# Altium schematic sheet 1XGSH00.SchDoc
size A4
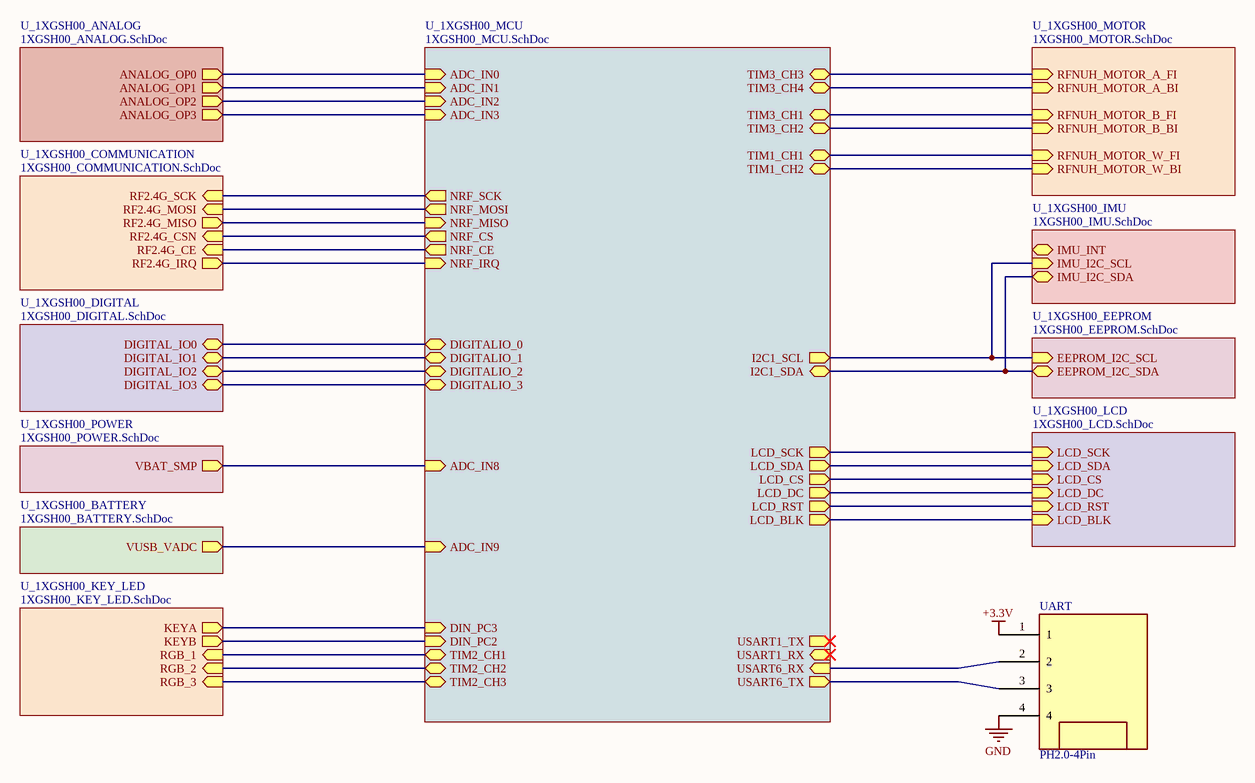
[diagram p0: 1XGSH00.SchDoc]

## Parts
UART  PH2.0-4Pin  [X1251WRS-04HF-LPSW]

## Sub-sheets
U_1XGSH00_ANALOG = 1XGSH00_ANALOG.SchDoc: ANALOG_OP0 (out), ANALOG_OP2 (out), ANALOG_OP3 (out), ANALOG_OP1 (out)
U_1XGSH00_BATTERY = 1XGSH00_BATTERY.SchDoc: VUSB_VADC (out)
U_1XGSH00_COMMUNICATION = 1XGSH00_COMMUNICATION.SchDoc: RF2.4G_SCK (in), RF2.4G_IRQ (out), RF2.4G_CE (in), RF2.4G_MISO (out), RF2.4G_MOSI (in), RF2.4G_CSN (in)
U_1XGSH00_DIGITAL = 1XGSH00_DIGITAL.SchDoc: DIGITAL_IO0 (bidir), DIGITAL_IO1 (bidir), DIGITAL_IO2 (bidir), DIGITAL_IO3 (bidir)
U_1XGSH00_EEPROM = 1XGSH00_EEPROM.SchDoc: EEPROM_I2C_SCL (in), EEPROM_I2C_SDA (bidir)
U_1XGSH00_IMU = 1XGSH00_IMU.SchDoc: IMU_I2C_SDA (bidir), IMU_I2C_SCL (in), IMU_INT (bidir)
U_1XGSH00_KEY_LED = 1XGSH00_KEY_LED.SchDoc: KEYA (out), KEYB (out), RGB_1 (in), RGB_2 (in), RGB_3 (in)
U_1XGSH00_LCD = 1XGSH00_LCD.SchDoc: LCD_SCK (in), LCD_SDA (in), LCD_DC (in), LCD_CS (in), LCD_RST (in), LCD_BLK (in)
U_1XGSH00_MCU = 1XGSH00_MCU.SchDoc: DIGITALIO_2 (bidir), DIGITALIO_3 (bidir), DIGITALIO_0 (bidir), DIGITALIO_1 (bidir), LCD_SCK (out), LCD_DC (out), LCD_BLK (out), LCD_SDA (out), LCD_CS (out), LCD_RST (out), TIM3_CH1 (bidir), ADC_IN8 (in), ADC_IN2 (in), NRF_CS (out), NRF_MISO (in), USART6_TX (out), TIM3_CH4 (bidir), USART1_RX (in), USART1_TX (out), TIM3_CH2 (bidir), TIM1_CH2 (bidir), TIM1_CH1 (bidir), I2C1_SCL (out), I2C1_SDA (bidir), ADC_IN3 (in), USART6_RX (in), TIM3_CH3 (bidir), TIM2_CH2 (bidir), NRF_CE (out), ADC_IN1 (in), NRF_IRQ (in), ADC_IN0 (in), NRF_SCK (out), NRF_MOSI (out), ADC_IN9 (in), TIM2_CH1 (bidir), TIM2_CH3 (bidir), DIN_PC2 (in), DIN_PC3 (in)
U_1XGSH00_MOTOR = 1XGSH00_MOTOR.SchDoc: RFNUH_MOTOR_W_BI (in), RFNUH_MOTOR_B_FI (in), RFNUH_MOTOR_A_FI (in), RFNUH_MOTOR_A_BI (in), RFNUH_MOTOR_W_FI (in), RFNUH_MOTOR_B_BI (in)
U_1XGSH00_POWER = 1XGSH00_POWER.SchDoc: VBAT_SMP (out)

## Nets
+3.3V: UART.1
GND: UART.4
NetUART_2: UART.2 ; sheet U_1XGSH00_MCU/USART6_RX
NetUART_3: UART.3 ; sheet U_1XGSH00_MCU/USART6_TX
(unnamed): sheet U_1XGSH00_ANALOG/ANALOG_OP0, sheet U_1XGSH00_MCU/ADC_IN0
(unnamed): sheet U_1XGSH00_ANALOG/ANALOG_OP2, sheet U_1XGSH00_MCU/ADC_IN2
(unnamed): sheet U_1XGSH00_ANALOG/ANALOG_OP3, sheet U_1XGSH00_MCU/ADC_IN3
(unnamed): sheet U_1XGSH00_ANALOG/ANALOG_OP1, sheet U_1XGSH00_MCU/ADC_IN1
(unnamed): sheet U_1XGSH00_BATTERY/VUSB_VADC, sheet U_1XGSH00_MCU/ADC_IN9
(unnamed): sheet U_1XGSH00_COMMUNICATION/RF2.4G_SCK, sheet U_1XGSH00_MCU/NRF_SCK
(unnamed): sheet U_1XGSH00_COMMUNICATION/RF2.4G_IRQ, sheet U_1XGSH00_MCU/NRF_IRQ
(unnamed): sheet U_1XGSH00_COMMUNICATION/RF2.4G_CE, sheet U_1XGSH00_MCU/NRF_CE
(unnamed): sheet U_1XGSH00_COMMUNICATION/RF2.4G_MISO, sheet U_1XGSH00_MCU/NRF_MISO
(unnamed): sheet U_1XGSH00_COMMUNICATION/RF2.4G_MOSI, sheet U_1XGSH00_MCU/NRF_MOSI
(unnamed): sheet U_1XGSH00_COMMUNICATION/RF2.4G_CSN, sheet U_1XGSH00_MCU/NRF_CS
(unnamed): sheet U_1XGSH00_DIGITAL/DIGITAL_IO0, sheet U_1XGSH00_MCU/DIGITALIO_0
(unnamed): sheet U_1XGSH00_DIGITAL/DIGITAL_IO1, sheet U_1XGSH00_MCU/DIGITALIO_1
(unnamed): sheet U_1XGSH00_DIGITAL/DIGITAL_IO2, sheet U_1XGSH00_MCU/DIGITALIO_2
(unnamed): sheet U_1XGSH00_DIGITAL/DIGITAL_IO3, sheet U_1XGSH00_MCU/DIGITALIO_3
(unnamed): sheet U_1XGSH00_MCU/LCD_SCK, sheet U_1XGSH00_LCD/LCD_SCK
(unnamed): sheet U_1XGSH00_MCU/LCD_DC, sheet U_1XGSH00_LCD/LCD_DC
(unnamed): sheet U_1XGSH00_MCU/LCD_BLK, sheet U_1XGSH00_LCD/LCD_BLK
(unnamed): sheet U_1XGSH00_MCU/LCD_SDA, sheet U_1XGSH00_LCD/LCD_SDA
(unnamed): sheet U_1XGSH00_MCU/LCD_CS, sheet U_1XGSH00_LCD/LCD_CS
(unnamed): sheet U_1XGSH00_MCU/LCD_RST, sheet U_1XGSH00_LCD/LCD_RST
(unnamed): sheet U_1XGSH00_MCU/TIM3_CH1, sheet U_1XGSH00_MOTOR/RFNUH_MOTOR_B_FI
(unnamed): sheet U_1XGSH00_MCU/ADC_IN8, sheet U_1XGSH00_POWER/VBAT_SMP
(unnamed): sheet U_1XGSH00_MCU/TIM3_CH4, sheet U_1XGSH00_MOTOR/RFNUH_MOTOR_A_BI
(unnamed): sheet U_1XGSH00_MCU/TIM3_CH2, sheet U_1XGSH00_MOTOR/RFNUH_MOTOR_B_BI
(unnamed): sheet U_1XGSH00_MCU/TIM1_CH2, sheet U_1XGSH00_MOTOR/RFNUH_MOTOR_W_BI
(unnamed): sheet U_1XGSH00_MCU/TIM1_CH1, sheet U_1XGSH00_MOTOR/RFNUH_MOTOR_W_FI
(unnamed): sheet U_1XGSH00_MCU/I2C1_SCL, sheet U_1XGSH00_IMU/IMU_I2C_SCL, sheet U_1XGSH00_EEPROM/EEPROM_I2C_SCL
(unnamed): sheet U_1XGSH00_MCU/I2C1_SDA, sheet U_1XGSH00_IMU/IMU_I2C_SDA, sheet U_1XGSH00_EEPROM/EEPROM_I2C_SDA
(unnamed): sheet U_1XGSH00_MCU/TIM3_CH3, sheet U_1XGSH00_MOTOR/RFNUH_MOTOR_A_FI
(unnamed): sheet U_1XGSH00_MCU/TIM2_CH2, sheet U_1XGSH00_KEY_LED/RGB_2
(unnamed): sheet U_1XGSH00_MCU/TIM2_CH1, sheet U_1XGSH00_KEY_LED/RGB_1
(unnamed): sheet U_1XGSH00_MCU/TIM2_CH3, sheet U_1XGSH00_KEY_LED/RGB_3
(unnamed): sheet U_1XGSH00_MCU/DIN_PC2, sheet U_1XGSH00_KEY_LED/KEYB
(unnamed): sheet U_1XGSH00_MCU/DIN_PC3, sheet U_1XGSH00_KEY_LED/KEYA